# EAGLE design info (EAGLE 9.6.2)
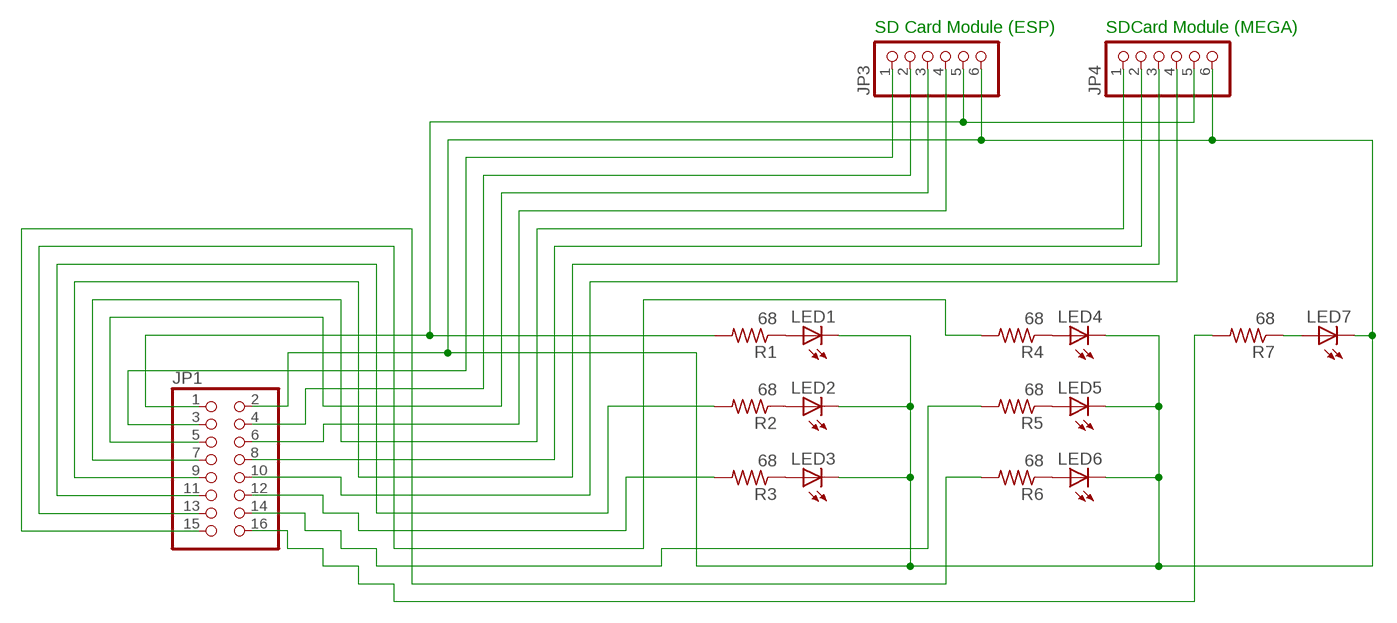
[diagram p0: schematic, sheet 1]

## Parts
JP1  PINHD-2X8/90  [2X08/90]
JP3  PINHD-1X6  [1X06]
JP4  PINHD-1X6  [1X06]
LED1  LED3MM  [LED3MM]
LED2  LED3MM  [LED3MM]
LED3  LED3MM  [LED3MM]
LED4  LED3MM  [LED3MM]
LED5  LED3MM  [LED3MM]
LED6  LED3MM  [LED3MM]
LED7  LED3MM  [LED3MM]
R1  68  R-US_0204/7  [0204/7]
R2  68  R-US_0204/7  [0204/7]
R3  68  R-US_0204/7  [0204/7]
R4  68  R-US_0204/7  [0204/7]
R5  68  R-US_0204/7  [0204/7]
R6  68  R-US_0204/7  [0204/7]
R7  68  R-US_0204/7  [0204/7]

## Nets
N$1: LED4.A R4.1
N$2: LED5.A R5.1
N$3: LED6.A R6.1
N$4: LED7.A R7.1
N$5: LED1.A R1.1
N$6: LED2.A R2.1
N$7: LED3.A R3.1
N$8: JP1.10 JP4.4
N$9: JP1.2 JP3.6 JP4.6 LED1.K(C) LED2.K(C) LED3.K(C) LED4.K(C) LED5.K(C) LED6.K(C) LED7.K(C)
N$10: JP1.11 R2.2
N$11: JP1.1 JP3.5 JP4.5 R1.2
N$12: JP1.3 JP3.1
N$13: JP1.4 JP3.2
N$14: JP1.5 JP3.3
N$15: JP1.6 JP3.4
N$16: JP1.7 JP4.1
N$17: JP1.8 JP4.2
N$18: JP1.9 JP4.3
N$19: JP1.12 R3.2
N$20: JP1.13 R4.2
N$22: JP1.14 R5.2
N$23: JP1.15 R6.2
N$24: JP1.16 R7.2

## Notes on the sheet
- SD Card Module (ESP) | SDCard Module (MEGA)

## Library data of the parts
JP1 = pinhead:PINHD-2X8: PIN HEADER
JP3 JP4 = adafruit:PINHD-1X6: PIN HEADER
LED1-LED7 = adafruit:LED: LED OSRAM: - CHIPLED LG R971, LG N971, LY N971, LG Q971, LY Q971, LO R971, LY R971 LH N974, LH R974 LS Q976, LO Q976, LY Q976 LO Q996 - Hyper CHIPLED LW Q18S LB Q993, LB Q99A, LB R99A - SideLED LS A670, LO A670, LY A670, LG A670, LP A670 LB A673, LV A673, LT A673, LW A673 LH A674 LY A675 LS A676, LA A676, LO A676, LY A676, LW A676 LS A679, LY A679, LG A679 - Hyper Micro SIDELED® LS Y876, LA Y876, LO Y876, LY Y876 LT Y87S - SmartLED LW L88C, LW L88S LB L89C, LB L89S, LG L890 LS L89K, LO L89K, LY L89K LS L896, LA L896, LO L896, LY L896 - TOPLED LS T670, LO T670, LY T670, LG T670, LP T670 LSG T670, LSP T670, LSY T670, LOP T670, LYG T670 LG T671, LOG T671, LSG T671 LB T673, LV T673, LT T673, LW T673 LH T674 LS T676, LA T676, LO T676, LY T676, LB T676, LH T676, LSB T676, LW T676 LB T67C, LV T67C, LT T67C, LS T67K, LO T67K, LY T67K, LW E67C LS E67B, LA E67B, LO E67B, LY E67B, LB E67C, LV E67C, LT E67C LW T67C LS T679, LY T679, LG T679 LS T770, LO T770, LY T770, LG T770, LP T770 LB T773, LV T773, LT T773, LW T773 LH T774 LS E675, LA E675, LY E675, LS T675 LS T776, LA T776, LO T776, LY T776, LB T776 LHGB T686 LT T68C, LB T68C - Hyper Mini TOPLED® LB M676 - Mini TOPLED Santana® LG M470 LS M47K, LO M47K, LY M47K Source: http://www.osram.convergy.de/
R1-R7 = adafruit:R-US_: RESISTOR, American symbol

## Board
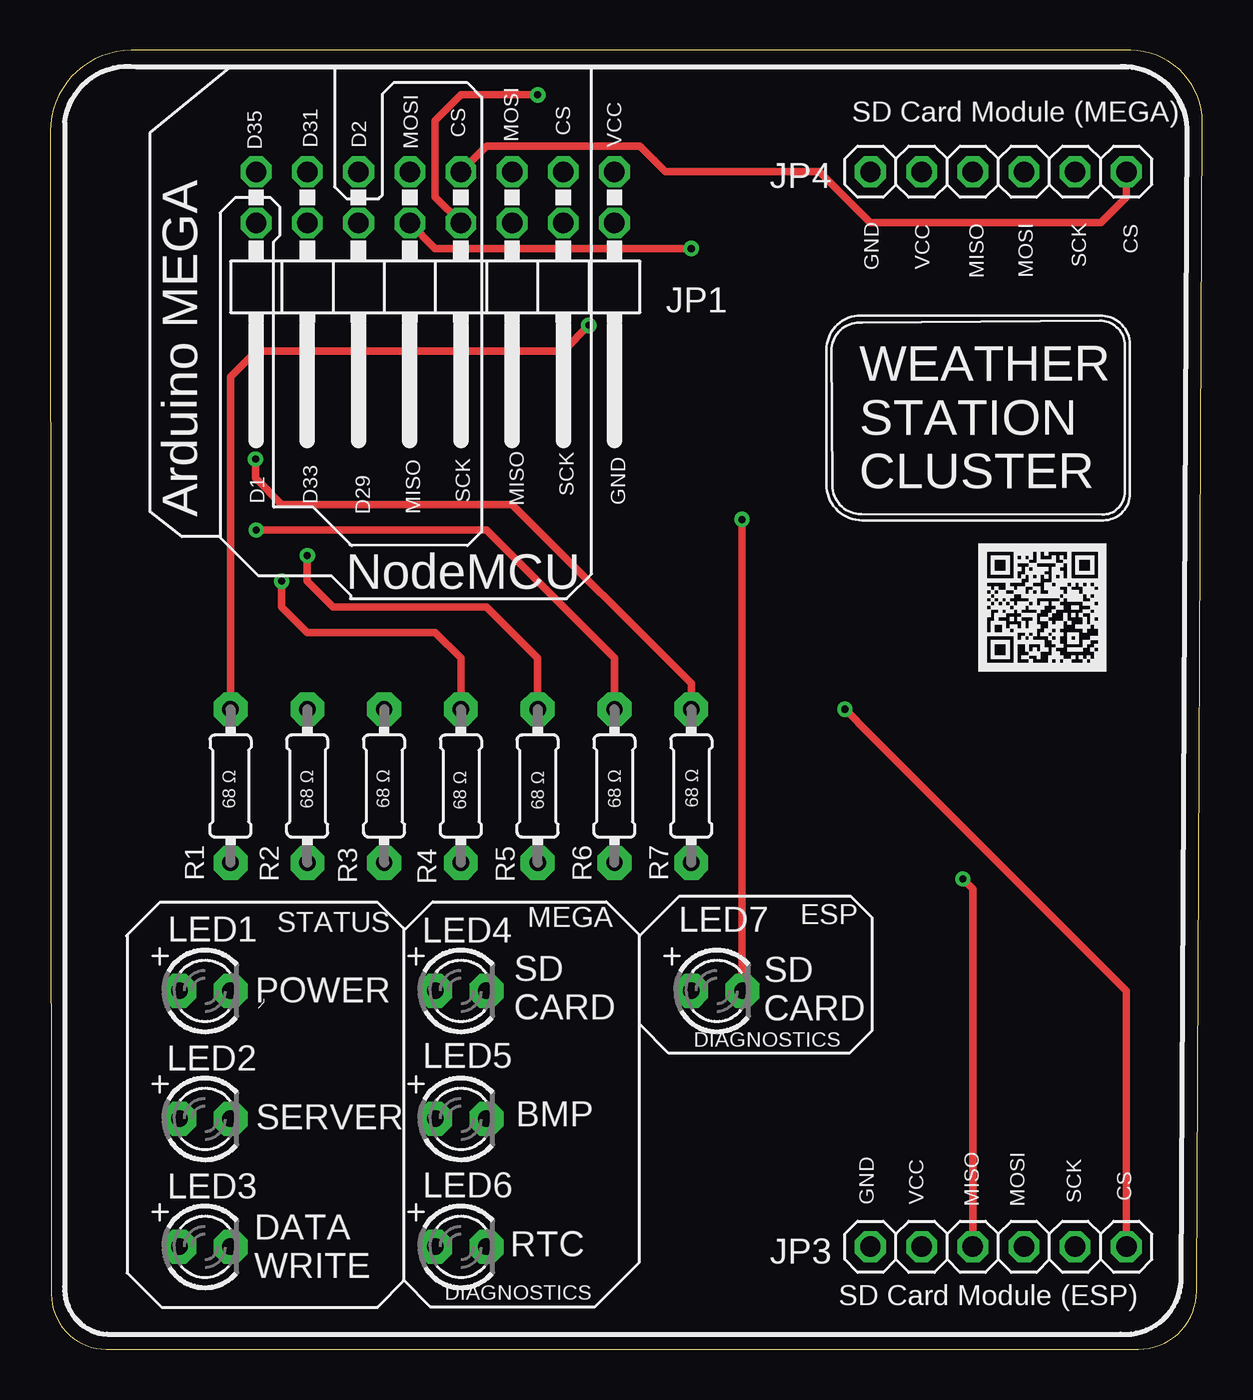
[diagram p1: board, top side]
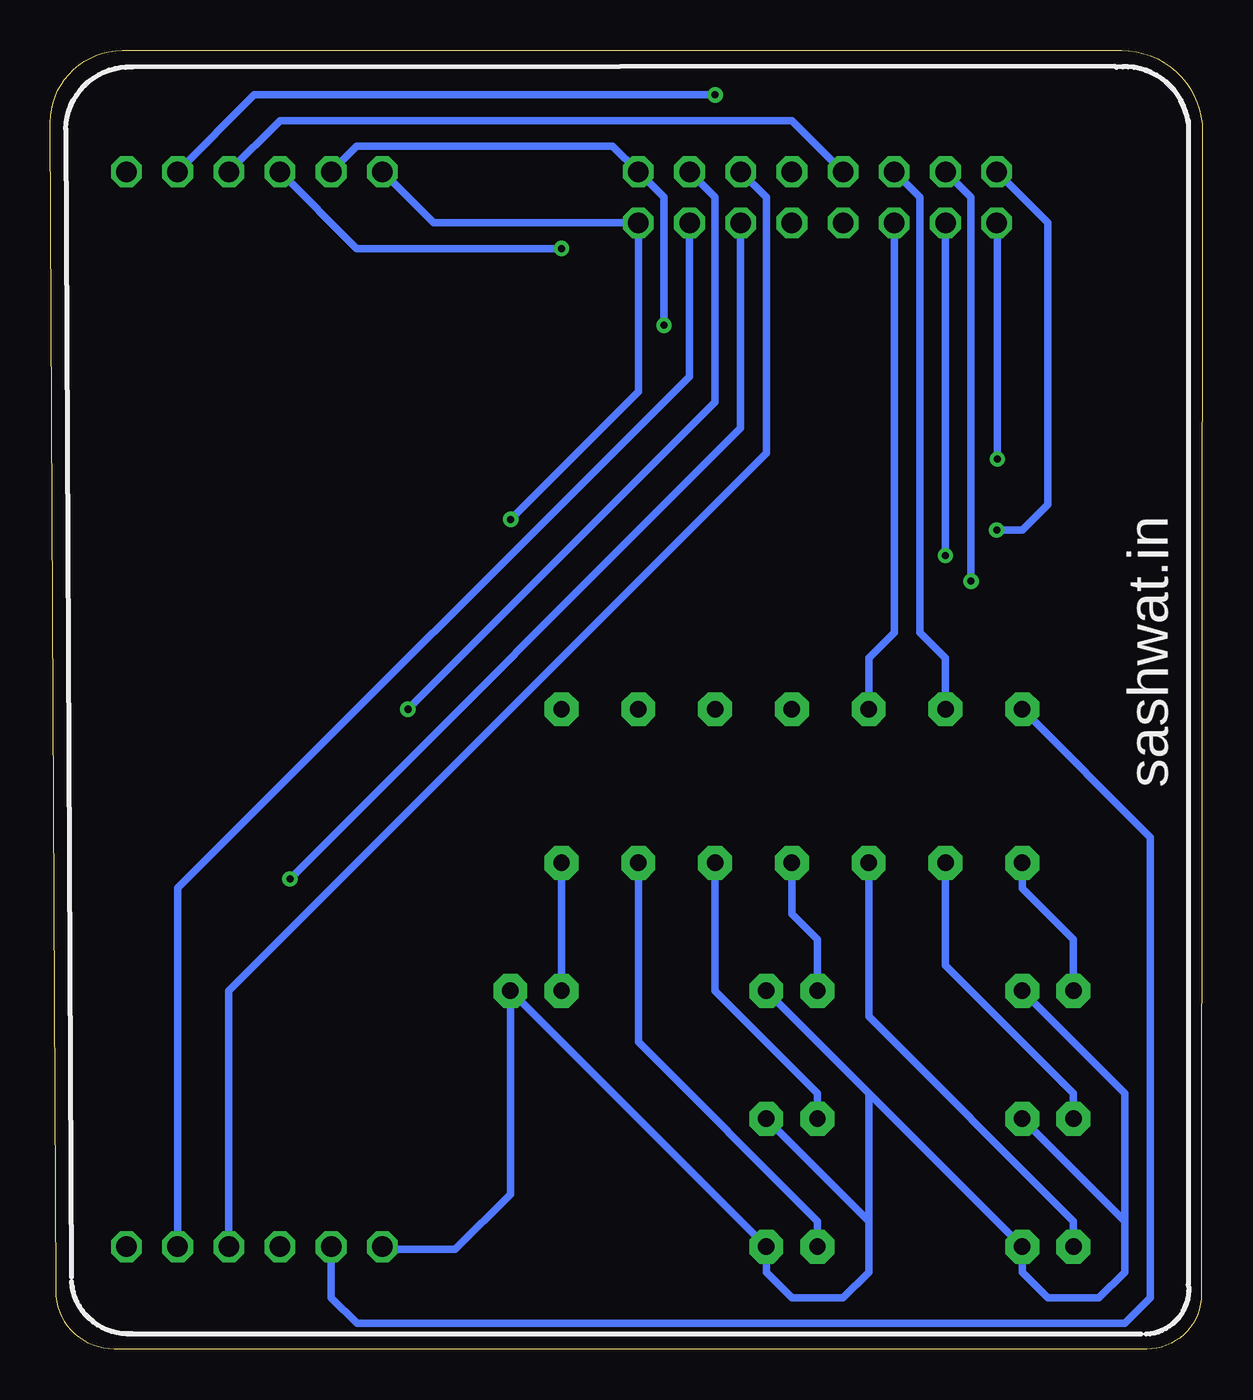
[diagram p2: board, bottom side, seen from below]

Size 57.16 x 64.44 mm. Coordinates in mm from the lower left corner, seen from the top.
Outline: 53.6,64.44 4.01,64.44 arc90 0,60.43 0.05,2.72 arc90 2.77,0 53.99,0 arc90 56.88,2.88 57.16,60.86 arc90 53.6,64.44
Copper layers (1*16): Top 0.035mm / dielectric 1.5mm / Bottom 0.035mm
Design rules "default": minimum track width 6mil, minimum drill 0.35mm, track to track 6mil, track to pad 6mil, pad to pad 6mil, via to via 6mil, smd to smd 6mil, copper to edge 40mil, drill to drill 6mil, minimum pad ring 10mil, minimum via ring 8mil, stop-mask expansion 4mil, vias tented up to drill 0mil, thermal gap 10mil

### Footprints (pad centres in the part's own frame; a part is rotated, then mirrored left to right if it is on the bottom)
2X08/90 = drill 1.016 octagon: 1 -8.89,-6.35; 2 -8.89,-3.81; 3 -6.35,-6.35; 4 -6.35,-3.81; 5 -3.81,-6.35; 6 -3.81,-3.81; 7 -1.27,-6.35; 8 -1.27,-3.81; 9 1.27,-6.35; 10 1.27,-3.81; 11 3.81,-6.35; 12 3.81,-3.81; 13 6.35,-6.35; 14 6.35,-3.81; 15 8.89,-6.35; 16 8.89,-3.81
1X06 = drill 1.016 octagon: 1 -6.35,0; 2 -3.81,0; 3 -1.27,0; 4 1.27,0; 5 3.81,0; 6 6.35,0
LED3MM = drill 0.813 pad 1.676 octagon: A -1.27,0; K 1.27,0
0204/7 = drill 0.813 pad 1.676 octagon: 1 -3.81,0; 2 3.81,0

### Placement (x,y rotation side)
JP1  19.1,52.07 180 top
JP3  47.04,5.08 180 top
JP4  47.04,58.42 180 top
LED1  7.67,17.78 0 top
LED2  7.67,11.43 0 top
LED3  7.67,5.08 0 top
LED4  20.37,17.78 0 top
LED5  20.37,11.43 0 top
LED6  20.37,5.08 0 top
LED7  33.07,17.78 0 top
R1  8.94,27.94 90 top
R2  12.75,27.94 90 top
R3  16.56,27.94 90 top
R4  20.37,27.94 90 top
R5  24.18,27.94 90 top
R6  27.99,27.94 90 top
R7  31.8,27.94 90 top

### Tracks (layer width: path | path; a pad name or v marks a point on that pad's centre or on a via)
N$1
  Bottom 0.381: LED4.A 19.1,20.32 20.37,21.59 R4.1
N$2
  Bottom 0.381: R5.1 24.18,17.78 19.1,12.7 LED5.A
N$3
  Bottom 0.381: R6.1 27.99,15.24 19.1,6.35 LED6.A
N$4
  Bottom 0.381: R7.1 LED7.A
N$5
  Bottom 0.381: LED1.A 6.4,20.32 8.94,22.86 R1.1
N$6
  Bottom 0.381: R2.1 12.75,19.05 6.4,12.7 LED2.A
N$7
  Bottom 0.381: R3.1 16.56,16.51 6.4,6.35 LED3.A
N$8  (via drill 0.35)
  Top 0.381: v31.8,54.61 19.1,54.61 JP1.10
  Bottom 0.381: JP4.4 41.96,54.61 v31.8,54.61
N$9  (via drill 0.35)
  Top 0.381: v34.32,41.17 34.32,17.8 LED7.K
  Bottom 0.152: 40.55,4.94 JP3.6
  Bottom 0.381: LED1.K 3.86,12.7 3.86,6.35 | LED2.K 3.86,6.35 | 3.86,6.35 3.86,3.81 5.13,2.54 7.67,2.54 8.94,3.81 LED3.K 16.56,12.7 | LED4.K 16.56,12.7 | 16.56,12.7 16.56,6.35 | 16.56,6.35 16.56,3.81 17.83,2.54 20.37,2.54 21.64,3.81 LED6.K LED7.K 34.34,7.68 37.08,4.94 40.55,4.94 | LED5.K 16.56,6.35 | JP4.6 38.15,55.88 JP1.2 27.99,47.5 v34.32,41.17
N$10
  Bottom 0.381: JP1.11 14.02,57.15 14.02,35.56 12.75,34.29 R2.2
N$11  (via drill 0.35)
  Top 0.381: v26.72,50.8 25.45,49.53 10.21,49.53 8.94,48.26 R1.2
  Bottom 0.381: v26.72,50.8 26.72,57.15 JP1.1 29.26,59.69 41.96,59.69 JP4.5 | R1.2 2.59,25.4 2.59,2.54 3.86,1.27 41.95,1.27 43.24,2.56 43.24,5.07 JP3.5
N$12  (via drill 0.35)
  Top 0.381: v39.42,31.75 40.69,30.48 53.39,17.78 JP3.1
  Bottom 0.381: JP1.3 24.18,57.15 24.18,46.99 v39.42,31.75
N$13
  Bottom 0.381: JP1.4 25.45,48.26 50.84,22.87 50.84,5.16 50.85,5.14 JP3.2
N$14
  Bottom 0.381: JP1.5 21.64,57.15 21.64,44.45 48.31,17.78 JP3.3
N$15  (via drill 0.35)
  Top 0.381: v45.27,23.32 45.77,22.83 JP3.4
  Bottom 0.381: JP1.6 22.91,45.69 v45.27,23.32
N$16
  Top 0.381: JP1.7 21.64,59.69 29.26,59.69 30.53,58.42 38.15,58.42 40.69,55.88 52.12,55.88 53.39,57.15 JP4.1
N$17  (via drill 0.35)
  Top 0.381: JP1.8 19.1,57.15 19.1,60.96 20.37,62.23 v24.18,62.23
  Bottom 0.381: JP4.2 47.04,62.23 v24.18,62.23
N$18
  Bottom 0.381: JP4.3 45.77,60.96 20.37,60.96 JP1.9
N$19
  Bottom 0.381: R3.2 16.56,34.29 15.29,35.56 JP1.12
N$20  (via drill 0.35)
  Top 0.381: v11.48,38.1 11.48,36.83 12.75,35.56 19.1,35.56 20.37,34.29 R4.2
  Bottom 0.381: JP1.13 11.48,57.15 v11.48,38.1
N$22  (via drill 0.35)
  Top 0.381: v12.75,39.37 12.75,38.1 14.02,36.83 21.64,36.83 24.18,34.29 R5.2
  Bottom 0.381: JP1.14 v12.75,39.37
N$23  (via drill 0.35)
  Top 0.381: R6.2 27.99,34.29 21.64,40.64 v10.21,40.64
  Bottom 0.381: JP1.15 7.67,55.88 7.67,41.91 8.94,40.64 v10.21,40.64
N$24  (via drill 0.35)
  Top 0.381: R7.2 31.8,33.02 22.91,41.91 11.48,41.91 10.18,43.21 v10.18,44.16
  Bottom 0.152: JP1.16 10.18,55.85
  Bottom 0.381: 10.18,55.85 v10.18,44.16

### Text on the board
tPlace: MOSI | D35 | D31 | VCC | D2 | CS | CS | SD Card Module (MEGA) | MOSI | GND | VCC | MISO | MOSI | SCK | CS | GND | D1 | D33 | D29 | SCK | WEATHER / STATION / CLUSTER | Arduino MEGA | MISO | SCK | MISO | NodeMCU | 68 Ω | 68 Ω | 68 Ω | 68 Ω | 68 Ω | 68 Ω | 68 Ω | ESP | STATUS | MEGA | POWER | SD / CARD | SD / CARD | DIAGNOSTICS | SERVER | BMP | GND | VCC | MISO | MOSI | SCK | CS | RTC | DATA / WRITE | DIAGNOSTICS | SD Card Module (ESP)
bPlace: sashwat.in